# Altium project 定子测试板_主板.PrjPcb
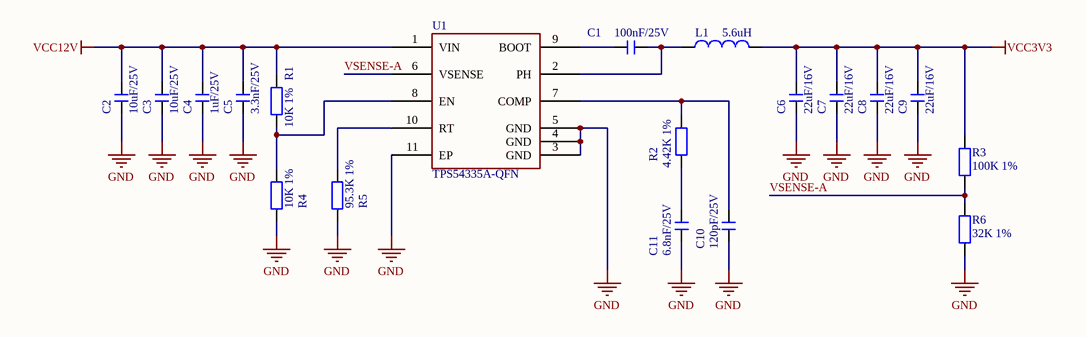
[diagram p0: PWR.SchDoc]
3 sheets, 49 parts. Net scope: global (net labels, ports and power ports of the same name join across sheets).
Board file: PCB1.PcbDoc
Sheets:
  PWR.SchDoc
  mcu.SchDoc
  Connector.SchDoc

## Sheet PWR.SchDoc
size A4; SheetNumber: 1; SheetTotal: 3

### Parts
C1  100nF/25V  [C0603_L]
C2  10uF/25V  [C0603_L]
C3  10uF/25V  [C0603_L]
C4  1uF/25V  [C0603_L]
C5  3.3nF/25V  [C0603_L]
C6  22uF/16V  [C0603_L]
C7  22uF/16V  [C0603_L]
C8  22uF/16V  [C0603_L]
C9  22uF/16V  [C0603_L]
C10  120pF/25V  [C0603_L]
C11  6.8nF/25V  [C0603_L]
L1  5.6uH  [NR4020]
R1  10K 1%  [R0603_L]
R2  4.42K 1%  [R0603_L]
R3  100K 1%  [R0603_L]
R4  10K 1%  [R0603_L]
R5  95.3K 1%  [R0603_L]
R6  32K 1%  [R0603_L]
U1  TPS54335A-QFN  [VSON-10_L3.0-W3.0-P0.50-TL-EP]

### Nets
GND: C2.1 C3.1 C4.1 C5.1 C6.1 C7.1 C8.1 C9.1 C10.1 C11.1 R4.2 R5.2 R6.2 U1.3(GND) U1.4(GND) U1.5(GND) U1.11(EP)
VCC3V3: C6.2 C7.2 C8.2 C9.2 L1.2 R3.1
VCC12V: C2.2 C3.2 C4.2 C5.2 R1.1 U1.1(VIN)
VSENSE-A: R3.2 R6.1 U1.6(VSENSE)
NetC1_1: C1.1 L1.1 U1.2(PH)
NetC1_2: C1.2 U1.9(BOOT)
NetC10_2: C10.2 R2.1 U1.7(COMP)
NetC11_2: C11.2 R2.2
NetR1_2: R1.2 R4.1 U1.8(EN)
NetR5_1: R5.1 U1.10(RT)

### Library data of the parts
C1-C11 = C: 无极性贴片电容; 版权归属: 源创客; 材质: X7R; BOM名称: 无极性贴片电容; 学习资源: www.ooocke.com
L1 = L: 小功率贴片电感; 版权归属: 源创客; BOM名称: 小功率贴片电感; 学习资源: www.ooocke.com
R1-R6 = R: 贴片电阻; 版权归属: 源创客; BOM名称: 贴片电阻; 学习资源: www.ooocke.com
U1 = TPS54335A-QFN: BUCK

## Sheet mcu.SchDoc
size A4; SheetNumber: 2; SheetTotal: 3
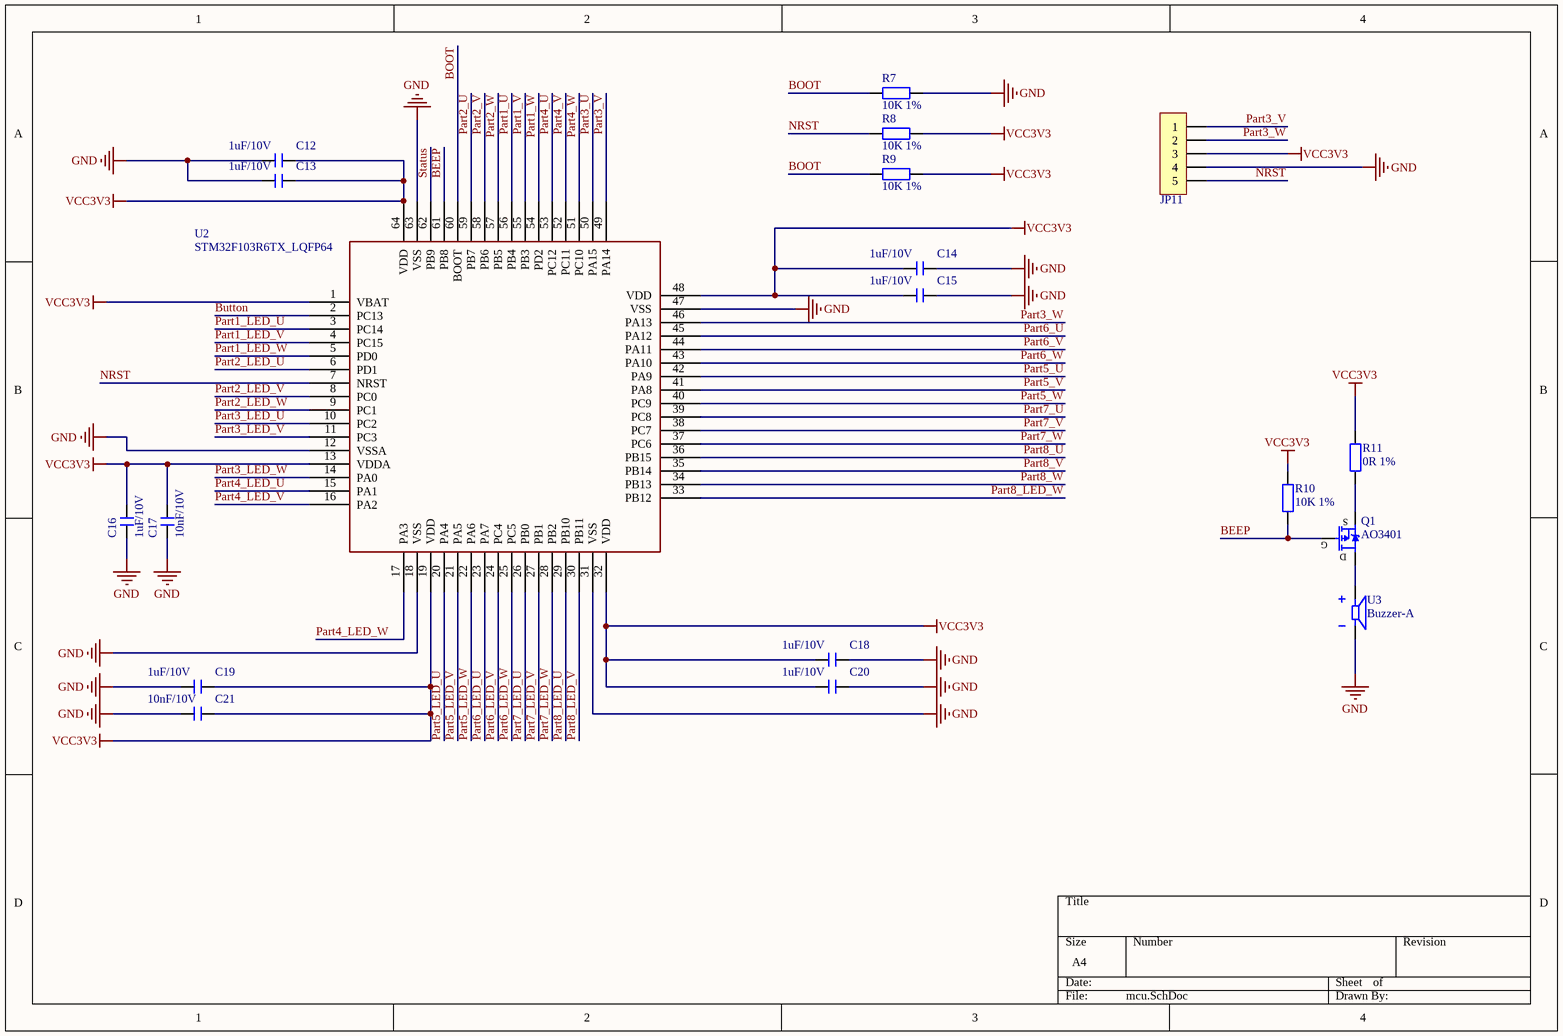
[diagram p1: mcu.SchDoc]

### Parts
C12  1uF/10V  [C0603_L]
C13  1uF/10V  [C0603_L]
C14  1uF/10V  [C0603_L]
C15  1uF/10V  [C0603_L]
C16  1uF/10V  [C0603_L]
C17  10nF/10V  [C0603_L]
C18  1uF/10V  [C0603_L]
C19  1uF/10V  [C0603_L]
C20  1uF/10V  [C0603_L]
C21  10nF/10V  [C0603_L]
JP11  HDR-1X5  [HDR2.54-LI-5P]  (value not drawn)
Q1  AO3401  [SOT23-3L]
R7  10K 1%  [R0603_L]
R8  10K 1%  [R0603_L]
R9  10K 1%  [R0603_L]
R10  10K 1%  [R0603_L]
R11  0R 1%  [R0603_L]
U2  STM32F103R6TX_LQFP64  [LQFP64 10x10_N]
U3  Buzzer-A  [BEEP 5x9x5.5]

### Nets
GND: C12.2 C13.2 C14.1 C15.1 C16.1 C17.1 C18.1 C19.2 C20.1 C21.2 JP11.4 R7.2 U2.12(VSSA) U2.18(VSS) U2.31(VSS) U2.47(VSS) U2.63(VSS) U3.2
VCC3V3: C12.1 C13.1 C14.2 C15.2 C16.2 C17.2 C18.2 C19.1 C20.2 C21.1 JP11.3 R8.2 R9.2 R10.2 R11.2 U2.1(VBAT) U2.13(VDDA) U2.19(VDD) U2.32(VDD) U2.48(VDD) U2.64(VDD)
BEEP: Q1.1(G) R10.1 U2.61(PB8)
BOOT: R7.1 R9.1 U2.60(BOOT)
Button: U2.2(PC13)
NRST: JP11.5 R8.1 U2.7(NRST)
Part1_LED_U: U2.3(PC14)
Part1_LED_V: U2.4(PC15)
Part1_LED_W: U2.5(PD0)
Part1_U: U2.56(PB4)
Part1_V: U2.55(PB3)
Part1_W: U2.54(PD2)
Part2_LED_U: U2.6(PD1)
Part2_LED_V: U2.8(PC0)
Part2_LED_W: U2.9(PC1)
Part2_U: U2.59(PB7)
Part2_V: U2.58(PB6)
Part2_W: U2.57(PB5)
Part3_LED_U: U2.10(PC2)
Part3_LED_V: U2.11(PC3)
Part3_LED_W: U2.14(PA0)
Part3_U: U2.50(PA15)
Part3_V: JP11.1 U2.49(PA14)
Part3_W: JP11.2 U2.46(PA13)
Part4_LED_U: U2.15(PA1)
Part4_LED_V: U2.16(PA2)
Part4_LED_W: U2.17(PA3)
Part4_U: U2.53(PC12)
Part4_V: U2.52(PC11)
Part4_W: U2.51(PC10)
Part5_LED_U: U2.20(PA4)
Part5_LED_V: U2.21(PA5)
Part5_LED_W: U2.22(PA6)
Part5_U: U2.42(PA9)
Part5_V: U2.41(PA8)
Part5_W: U2.40(PC9)
Part6_LED_U: U2.23(PA7)
Part6_LED_V: U2.24(PC4)
Part6_LED_W: U2.25(PC5)
Part6_U: U2.45(PA12)
Part6_V: U2.44(PA11)
Part6_W: U2.43(PA10)
Part7_LED_U: U2.26(PB0)
Part7_LED_V: U2.27(PB1)
Part7_LED_W: U2.28(PB2)
Part7_U: U2.39(PC8)
Part7_V: U2.38(PC7)
Part7_W: U2.37(PC6)
Part8_LED_U: U2.29(PB10)
Part8_LED_V: U2.30(PB11)
Part8_LED_W: U2.33(PB12)
Part8_U: U2.36(PB15)
Part8_V: U2.35(PB14)
Part8_W: U2.34(PB13)
Status: U2.62(PB9)
NetQ1_2: Q1.2(S) R11.1
NetQ1_3: Q1.3(D) U3.1

### Library data of the parts
C12-C21 = C: 无极性贴片电容; 版权归属: 源创客; 材质: X7R; BOM名称: 无极性贴片电容; 学习资源: www.ooocke.com
JP11 = Header 5: 5P接插件; 版权归属: 源创客; BOM名称: 5P接插件; 学习资源: www.ooocke.com
Q1 = AO3401: P沟道 30V/4.2A; BOM名称: 场效应管; 版权归属: 源创客; 学习资源: www.ooocke.com; 描述: P沟道 30V/4.2A
R7-R11 = R: 贴片电阻; 版权归属: 源创客; BOM名称: 贴片电阻; 学习资源: www.ooocke.com
U3 = Buzzer-A: 有源蜂鸣器

## Sheet Connector.SchDoc
size A4; SheetNumber: 3; SheetTotal: 3
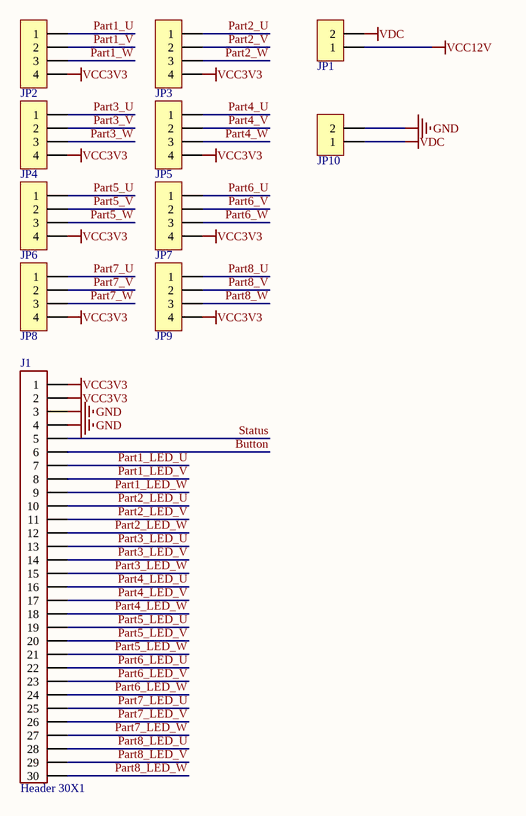
[diagram p2: Connector.SchDoc]

### Parts
J1  Header 30X1  [FPC1.0-2H-WS-30P]
JP1  HDR-1X2  [XH2.54-LI-2P]  (value not drawn)
JP2  HDR-1X4  [XH2.54-LI-4P]  (value not drawn)
JP3  HDR-1X4  [XH2.54-LI-4P]  (value not drawn)
JP4  HDR-1X4  [XH2.54-LI-4P]  (value not drawn)
JP5  HDR-1X4  [XH2.54-LI-4P]  (value not drawn)
JP6  HDR-1X4  [XH2.54-LI-4P]  (value not drawn)
JP7  HDR-1X4  [XH2.54-LI-4P]  (value not drawn)
JP8  HDR-1X4  [XH2.54-LI-4P]  (value not drawn)
JP9  HDR-1X4  [XH2.54-LI-4P]  (value not drawn)
JP10  HDR-1X2  [XH2.54-LI-2P]  (value not drawn)

### Nets
GND: J1.3 J1.4 JP10.2
VCC3V3: J1.1 J1.2 JP2.4 JP3.4 JP4.4 JP5.4 JP6.4 JP7.4 JP8.4 JP9.4
VCC12V: JP1.1
VDC: JP1.2 JP10.1
Button: J1.6
Part1_LED_U: J1.7
Part1_LED_V: J1.8
Part1_LED_W: J1.9
Part1_U: JP2.1
Part1_V: JP2.2
Part1_W: JP2.3
Part2_LED_U: J1.10
Part2_LED_V: J1.11
Part2_LED_W: J1.12
Part2_U: JP3.1
Part2_V: JP3.2
Part2_W: JP3.3
Part3_LED_U: J1.13
Part3_LED_V: J1.14
Part3_LED_W: J1.15
Part3_U: JP4.1
Part3_V: JP4.2
Part3_W: JP4.3
Part4_LED_U: J1.16
Part4_LED_V: J1.17
Part4_LED_W: J1.18
Part4_U: JP5.1
Part4_V: JP5.2
Part4_W: JP5.3
Part5_LED_U: J1.19
Part5_LED_V: J1.20
Part5_LED_W: J1.21
Part5_U: JP6.1
Part5_V: JP6.2
Part5_W: JP6.3
Part6_LED_U: J1.22
Part6_LED_V: J1.23
Part6_LED_W: J1.24
Part6_U: JP7.1
Part6_V: JP7.2
Part6_W: JP7.3
Part7_LED_U: J1.25
Part7_LED_V: J1.26
Part7_LED_W: J1.27
Part7_U: JP8.1
Part7_V: JP8.2
Part7_W: JP8.3
Part8_LED_U: J1.28
Part8_LED_V: J1.29
Part8_LED_W: J1.30
Part8_U: JP9.1
Part8_V: JP9.2
Part8_W: JP9.3
Status: J1.5

### Library data of the parts
JP1 JP10 = Header 2: 2P接插件; 版权归属: 源创客; BOM名称: 2P接插件; 学习资源: www.ooocke.com
JP2-JP9 = Header 4: 4P接插件; 版权归属: 源创客; BOM名称: 4P接插件; 学习资源: www.ooocke.com

## Nets that join several sheets
GND: PWR (17 pins), mcu (18 pins), Connector (J1.3 J1.4 JP10.2)
VCC3V3: PWR (6 pins), mcu (21 pins), Connector (10 pins)
VCC12V: PWR (6 pins), Connector (JP1.1)
Button: mcu (U2.2), Connector (J1.6)
Part1_LED_U: mcu (U2.3), Connector (J1.7)
Part1_LED_V: mcu (U2.4), Connector (J1.8)
Part1_LED_W: mcu (U2.5), Connector (J1.9)
Part1_U: mcu (U2.56), Connector (JP2.1)
Part1_V: mcu (U2.55), Connector (JP2.2)
Part1_W: mcu (U2.54), Connector (JP2.3)
Part2_LED_U: mcu (U2.6), Connector (J1.10)
Part2_LED_V: mcu (U2.8), Connector (J1.11)
Part2_LED_W: mcu (U2.9), Connector (J1.12)
Part2_U: mcu (U2.59), Connector (JP3.1)
Part2_V: mcu (U2.58), Connector (JP3.2)
Part2_W: mcu (U2.57), Connector (JP3.3)
Part3_LED_U: mcu (U2.10), Connector (J1.13)
Part3_LED_V: mcu (U2.11), Connector (J1.14)
Part3_LED_W: mcu (U2.14), Connector (J1.15)
Part3_U: mcu (U2.50), Connector (JP4.1)
Part3_V: mcu (JP11.1 U2.49), Connector (JP4.2)
Part3_W: mcu (JP11.2 U2.46), Connector (JP4.3)
Part4_LED_U: mcu (U2.15), Connector (J1.16)
Part4_LED_V: mcu (U2.16), Connector (J1.17)
Part4_LED_W: mcu (U2.17), Connector (J1.18)
Part4_U: mcu (U2.53), Connector (JP5.1)
Part4_V: mcu (U2.52), Connector (JP5.2)
Part4_W: mcu (U2.51), Connector (JP5.3)
Part5_LED_U: mcu (U2.20), Connector (J1.19)
Part5_LED_V: mcu (U2.21), Connector (J1.20)
Part5_LED_W: mcu (U2.22), Connector (J1.21)
Part5_U: mcu (U2.42), Connector (JP6.1)
Part5_V: mcu (U2.41), Connector (JP6.2)
Part5_W: mcu (U2.40), Connector (JP6.3)
Part6_LED_U: mcu (U2.23), Connector (J1.22)
Part6_LED_V: mcu (U2.24), Connector (J1.23)
Part6_LED_W: mcu (U2.25), Connector (J1.24)
Part6_U: mcu (U2.45), Connector (JP7.1)
Part6_V: mcu (U2.44), Connector (JP7.2)
Part6_W: mcu (U2.43), Connector (JP7.3)
Part7_LED_U: mcu (U2.26), Connector (J1.25)
Part7_LED_V: mcu (U2.27), Connector (J1.26)
Part7_LED_W: mcu (U2.28), Connector (J1.27)
Part7_U: mcu (U2.39), Connector (JP8.1)
Part7_V: mcu (U2.38), Connector (JP8.2)
Part7_W: mcu (U2.37), Connector (JP8.3)
Part8_LED_U: mcu (U2.29), Connector (J1.28)
Part8_LED_V: mcu (U2.30), Connector (J1.29)
Part8_LED_W: mcu (U2.33), Connector (J1.30)
Part8_U: mcu (U2.36), Connector (JP9.1)
Part8_V: mcu (U2.35), Connector (JP9.2)
Part8_W: mcu (U2.34), Connector (JP9.3)
Status: mcu (U2.62), Connector (J1.5)